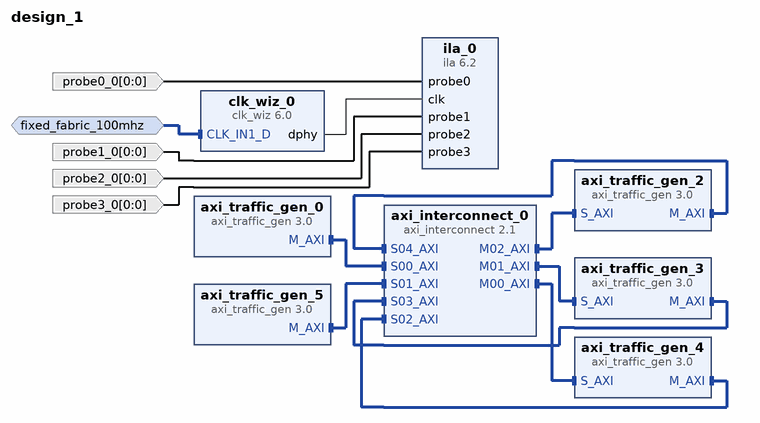
[diagram p0: block diagram of the top level]
# Vivado block design design_1, xcau25p-ffvb676-2-e, Vivado 2023.2
create_bd_design design_1

create_bd_intf_port -mode Slave -vlnv xilinx.com:interface:diff_clock_rtl:1.0 fixed_fabric_100mhz
set_property -dict {CONFIG.FREQ_HZ 100000000} [get_bd_intf_ports fixed_fabric_100mhz]
create_bd_port -dir I -from 0 -to 0 probe0_0
create_bd_port -dir I -from 0 -to 0 probe1_0
create_bd_port -dir I -from 0 -to 0 probe2_0
create_bd_port -dir I -from 0 -to 0 probe3_0

create_bd_cell -type ip -vlnv xilinx.com:ip:clk_wiz:6.0 clk_wiz_0
set_property -dict [list \
  CONFIG.CLKOUT1_JITTER 102.086 \
  CONFIG.CLKOUT1_PHASE_ERROR 87.180 \
  CONFIG.CLKOUT1_REQUESTED_OUT_FREQ 200 \
  CONFIG.CLKOUT2_JITTER 102.086 \
  CONFIG.CLKOUT2_PHASE_ERROR 87.180 \
  CONFIG.CLKOUT2_REQUESTED_OUT_FREQ 100.000 \
  CONFIG.CLKOUT2_USED false \
  CONFIG.CLKOUT3_JITTER 94.862 \
  CONFIG.CLKOUT3_PHASE_ERROR 87.180 \
  CONFIG.CLKOUT3_REQUESTED_OUT_FREQ 100.000 \
  CONFIG.CLKOUT3_USED false \
  CONFIG.CLKOUT4_JITTER 94.862 \
  CONFIG.CLKOUT4_PHASE_ERROR 87.180 \
  CONFIG.CLKOUT4_REQUESTED_OUT_FREQ 100.000 \
  CONFIG.CLKOUT4_USED false \
  CONFIG.CLK_IN1_BOARD_INTERFACE fixed_fabric_100mhz \
  CONFIG.CLK_OUT1_PORT dphy \
  CONFIG.CLK_OUT2_PORT clk_out2 \
  CONFIG.CLK_OUT3_PORT clk_out3 \
  CONFIG.CLK_OUT4_PORT clk_out4 \
  CONFIG.MMCM_CLKFBOUT_MULT_F 12.000 \
  CONFIG.MMCM_CLKIN1_PERIOD 10.000 \
  CONFIG.MMCM_CLKIN2_PERIOD 10.000 \
  CONFIG.MMCM_CLKOUT0_DIVIDE_F 6.000 \
  CONFIG.MMCM_CLKOUT1_DIVIDE 1 \
  CONFIG.MMCM_CLKOUT2_DIVIDE 1 \
  CONFIG.MMCM_CLKOUT3_DIVIDE 1 \
  CONFIG.NUM_OUT_CLKS 1 \
  CONFIG.PRIM_SOURCE Differential_clock_capable_pin \
  CONFIG.RESET_PORT reset \
  CONFIG.RESET_TYPE ACTIVE_HIGH \
  CONFIG.USE_BOARD_FLOW true \
  CONFIG.USE_RESET false \
] [get_bd_cells clk_wiz_0]
create_bd_cell -type ip -vlnv xilinx.com:ip:ila:6.2 ila_0
set_property -dict [list \
  CONFIG.C_MONITOR_TYPE Native \
  CONFIG.C_NUM_OF_PROBES 4 \
  CONFIG.C_PROBE0_WIDTH 1 \
  CONFIG.C_PROBE1_WIDTH 1 \
  CONFIG.C_PROBE2_WIDTH 1 \
] [get_bd_cells ila_0]
create_bd_cell -type ip -vlnv xilinx.com:ip:axi_interconnect:2.1 axi_interconnect_0
set_property -dict {CONFIG.NUM_MI 3 CONFIG.NUM_SI 5} [get_bd_cells axi_interconnect_0]
create_bd_cell -type ip -vlnv xilinx.com:ip:axi_traffic_gen:3.0 axi_traffic_gen_0
create_bd_cell -type ip -vlnv xilinx.com:ip:axi_traffic_gen:3.0 axi_traffic_gen_2
create_bd_cell -type ip -vlnv xilinx.com:ip:axi_traffic_gen:3.0 axi_traffic_gen_3
create_bd_cell -type ip -vlnv xilinx.com:ip:axi_traffic_gen:3.0 axi_traffic_gen_4
create_bd_cell -type ip -vlnv xilinx.com:ip:axi_traffic_gen:3.0 axi_traffic_gen_5

# ---- connections ----

connect_bd_intf_net [get_bd_intf_pins axi_interconnect_0/M00_AXI] [get_bd_intf_pins axi_traffic_gen_4/S_AXI]
connect_bd_intf_net [get_bd_intf_pins axi_interconnect_0/M01_AXI] [get_bd_intf_pins axi_traffic_gen_3/S_AXI]
connect_bd_intf_net [get_bd_intf_pins axi_interconnect_0/M02_AXI] [get_bd_intf_pins axi_traffic_gen_2/S_AXI]
connect_bd_intf_net [get_bd_intf_pins axi_traffic_gen_0/M_AXI] [get_bd_intf_pins axi_interconnect_0/S00_AXI]
connect_bd_intf_net [get_bd_intf_pins axi_traffic_gen_2/M_AXI] [get_bd_intf_pins axi_interconnect_0/S04_AXI]
connect_bd_intf_net [get_bd_intf_pins axi_traffic_gen_3/M_AXI] [get_bd_intf_pins axi_interconnect_0/S03_AXI]
connect_bd_intf_net [get_bd_intf_pins axi_traffic_gen_4/M_AXI] [get_bd_intf_pins axi_interconnect_0/S02_AXI]
connect_bd_intf_net [get_bd_intf_pins axi_traffic_gen_5/M_AXI] [get_bd_intf_pins axi_interconnect_0/S01_AXI]
connect_bd_intf_net [get_bd_intf_ports fixed_fabric_100mhz] [get_bd_intf_pins clk_wiz_0/CLK_IN1_D]
connect_bd_net [get_bd_pins clk_wiz_0/dphy] [get_bd_pins ila_0/clk]
connect_bd_net -net probe0_0_1 [get_bd_ports probe0_0] [get_bd_pins ila_0/probe0]
connect_bd_net -net probe1_0_1 [get_bd_ports probe1_0] [get_bd_pins ila_0/probe1]
connect_bd_net -net probe2_0_1 [get_bd_ports probe2_0] [get_bd_pins ila_0/probe2]
connect_bd_net -net probe3_0_1 [get_bd_ports probe3_0] [get_bd_pins ila_0/probe3]
set_property HDL_ATTRIBUTE.DEBUG true [get_bd_nets probe0_0_1]
set_property HDL_ATTRIBUTE.MARK_DEBUG true [get_bd_nets probe0_0_1]
set_property HDL_ATTRIBUTE.DEBUG true [get_bd_nets probe1_0_1]
set_property HDL_ATTRIBUTE.MARK_DEBUG true [get_bd_nets probe1_0_1]
set_property HDL_ATTRIBUTE.DEBUG true [get_bd_nets probe2_0_1]
set_property HDL_ATTRIBUTE.MARK_DEBUG true [get_bd_nets probe2_0_1]
set_property HDL_ATTRIBUTE.DEBUG true [get_bd_nets probe3_0_1]
set_property HDL_ATTRIBUTE.MARK_DEBUG true [get_bd_nets probe3_0_1]

# ---- address map ----
assign_bd_address -offset 0x44A00000 -range 64K -target_address_space [get_bd_addr_spaces axi_traffic_gen_0/Data] [get_bd_addr_segs axi_traffic_gen_2/S_AXI/Reg0]
assign_bd_address -offset 0x44A10000 -range 64K -target_address_space [get_bd_addr_spaces axi_traffic_gen_0/Data] [get_bd_addr_segs axi_traffic_gen_3/S_AXI/Reg0]
assign_bd_address -offset 0x44A20000 -range 64K -target_address_space [get_bd_addr_spaces axi_traffic_gen_0/Data] [get_bd_addr_segs axi_traffic_gen_4/S_AXI/Reg0]
assign_bd_address -offset 0x44A00000 -range 64K -target_address_space [get_bd_addr_spaces axi_traffic_gen_2/Data] [get_bd_addr_segs axi_traffic_gen_2/S_AXI/Reg0]
assign_bd_address -offset 0x44A10000 -range 64K -target_address_space [get_bd_addr_spaces axi_traffic_gen_2/Data] [get_bd_addr_segs axi_traffic_gen_3/S_AXI/Reg0]
assign_bd_address -offset 0x44A20000 -range 64K -target_address_space [get_bd_addr_spaces axi_traffic_gen_2/Data] [get_bd_addr_segs axi_traffic_gen_4/S_AXI/Reg0]
assign_bd_address -offset 0x44A00000 -range 64K -target_address_space [get_bd_addr_spaces axi_traffic_gen_3/Data] [get_bd_addr_segs axi_traffic_gen_2/S_AXI/Reg0]
assign_bd_address -offset 0x44A10000 -range 64K -target_address_space [get_bd_addr_spaces axi_traffic_gen_3/Data] [get_bd_addr_segs axi_traffic_gen_3/S_AXI/Reg0]
assign_bd_address -offset 0x44A20000 -range 64K -target_address_space [get_bd_addr_spaces axi_traffic_gen_3/Data] [get_bd_addr_segs axi_traffic_gen_4/S_AXI/Reg0]
assign_bd_address -offset 0x44A00000 -range 64K -target_address_space [get_bd_addr_spaces axi_traffic_gen_4/Data] [get_bd_addr_segs axi_traffic_gen_2/S_AXI/Reg0]
assign_bd_address -offset 0x44A10000 -range 64K -target_address_space [get_bd_addr_spaces axi_traffic_gen_4/Data] [get_bd_addr_segs axi_traffic_gen_3/S_AXI/Reg0]
assign_bd_address -offset 0x44A20000 -range 64K -target_address_space [get_bd_addr_spaces axi_traffic_gen_4/Data] [get_bd_addr_segs axi_traffic_gen_4/S_AXI/Reg0]
assign_bd_address -offset 0x44A00000 -range 64K -target_address_space [get_bd_addr_spaces axi_traffic_gen_5/Data] [get_bd_addr_segs axi_traffic_gen_2/S_AXI/Reg0]
assign_bd_address -offset 0x44A10000 -range 64K -target_address_space [get_bd_addr_spaces axi_traffic_gen_5/Data] [get_bd_addr_segs axi_traffic_gen_3/S_AXI/Reg0]
assign_bd_address -offset 0x44A20000 -range 64K -target_address_space [get_bd_addr_spaces axi_traffic_gen_5/Data] [get_bd_addr_segs axi_traffic_gen_4/S_AXI/Reg0]

validate_bd_design
save_bd_design
